# EAGLE design Two Nine Five Rev 1 (EAGLE 9.0.0)
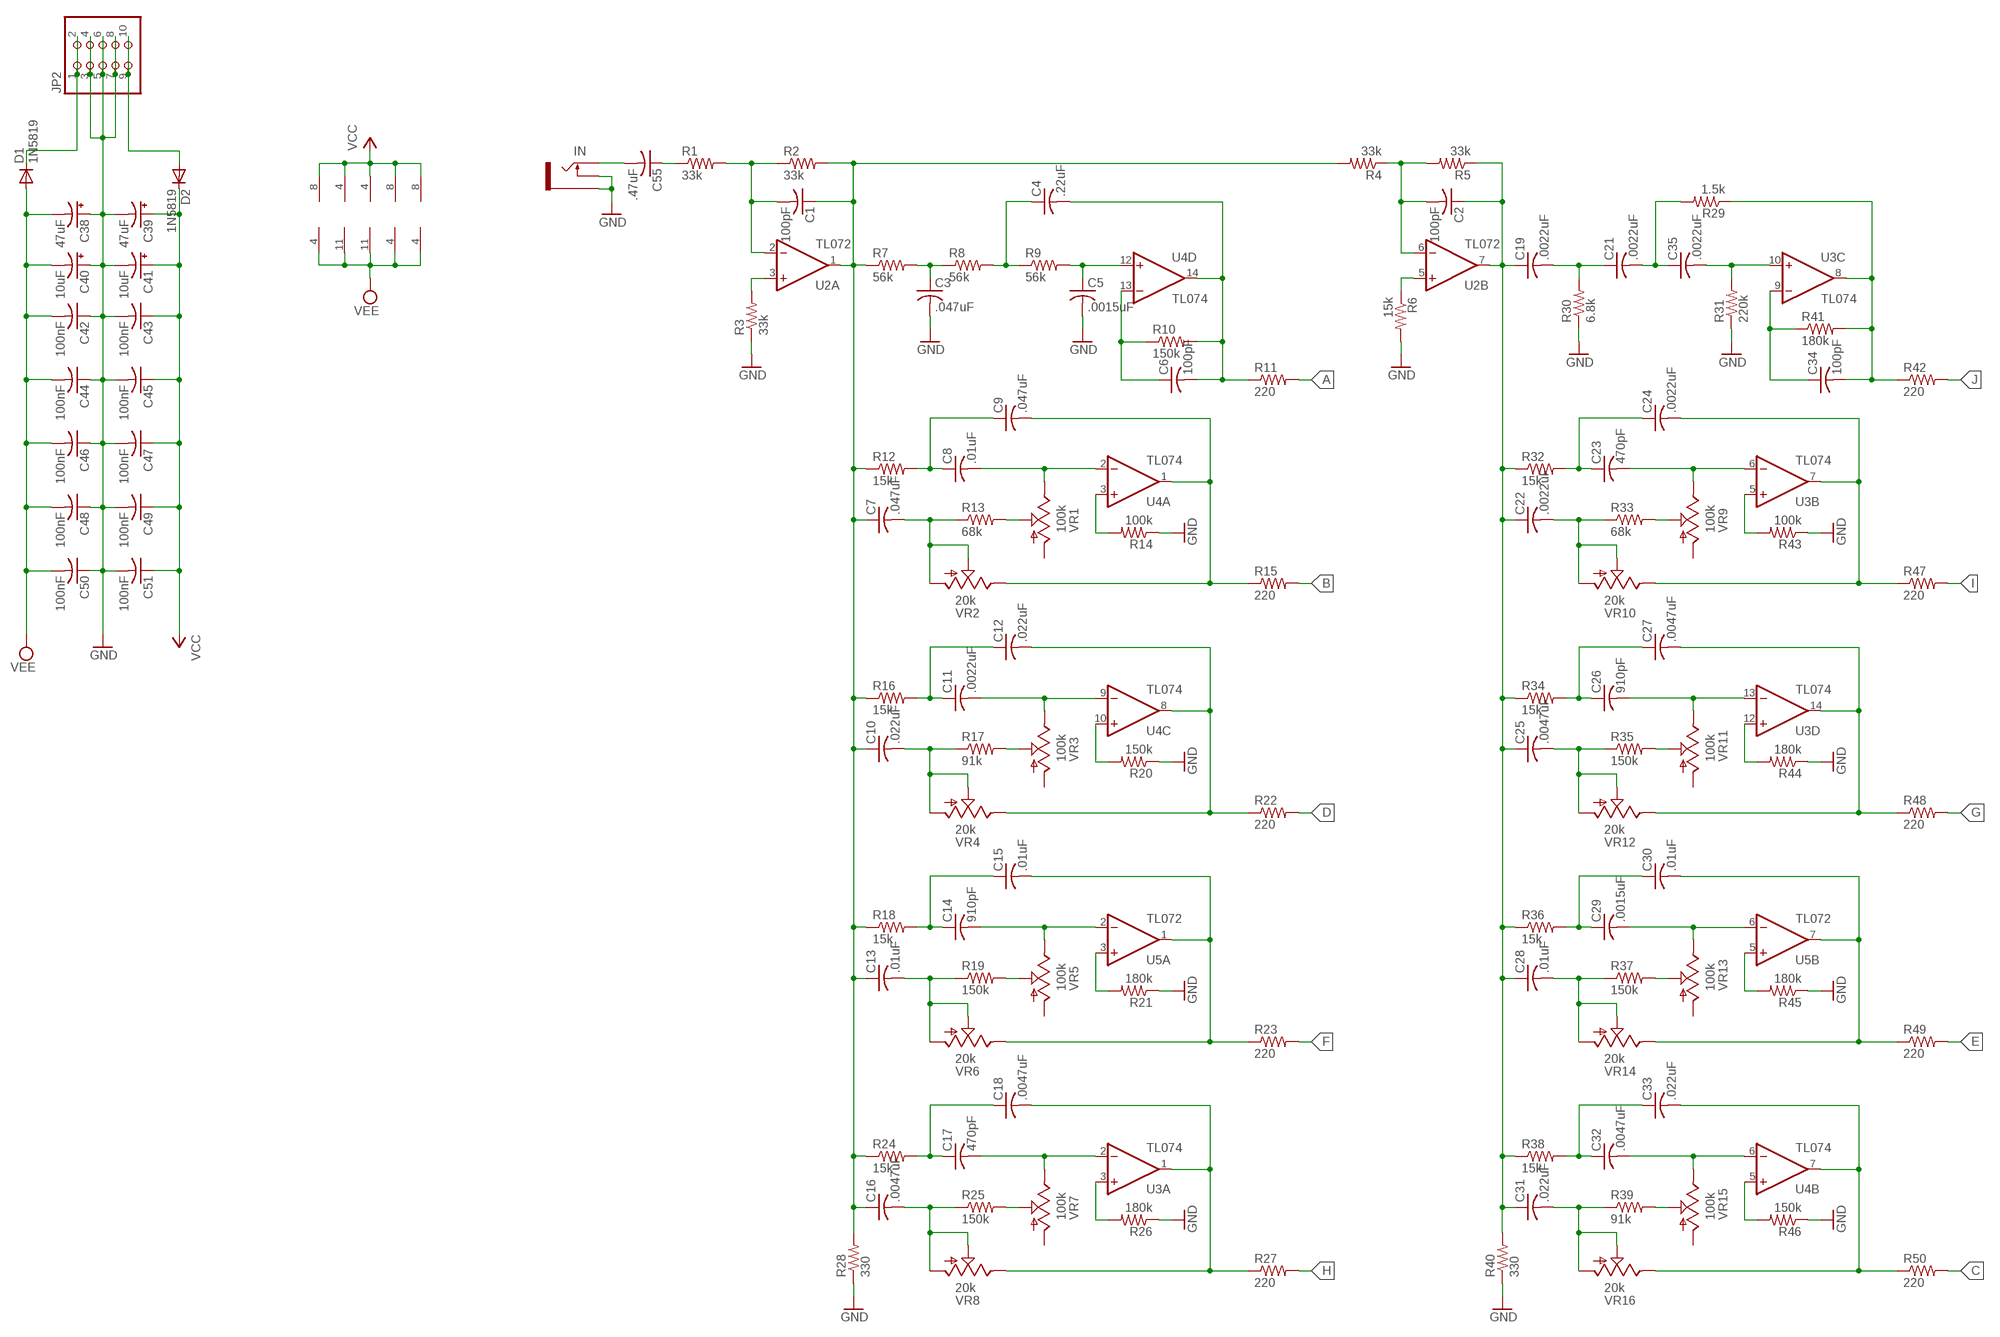
[diagram p0: schematic, sheet 1, part 1 of 2]
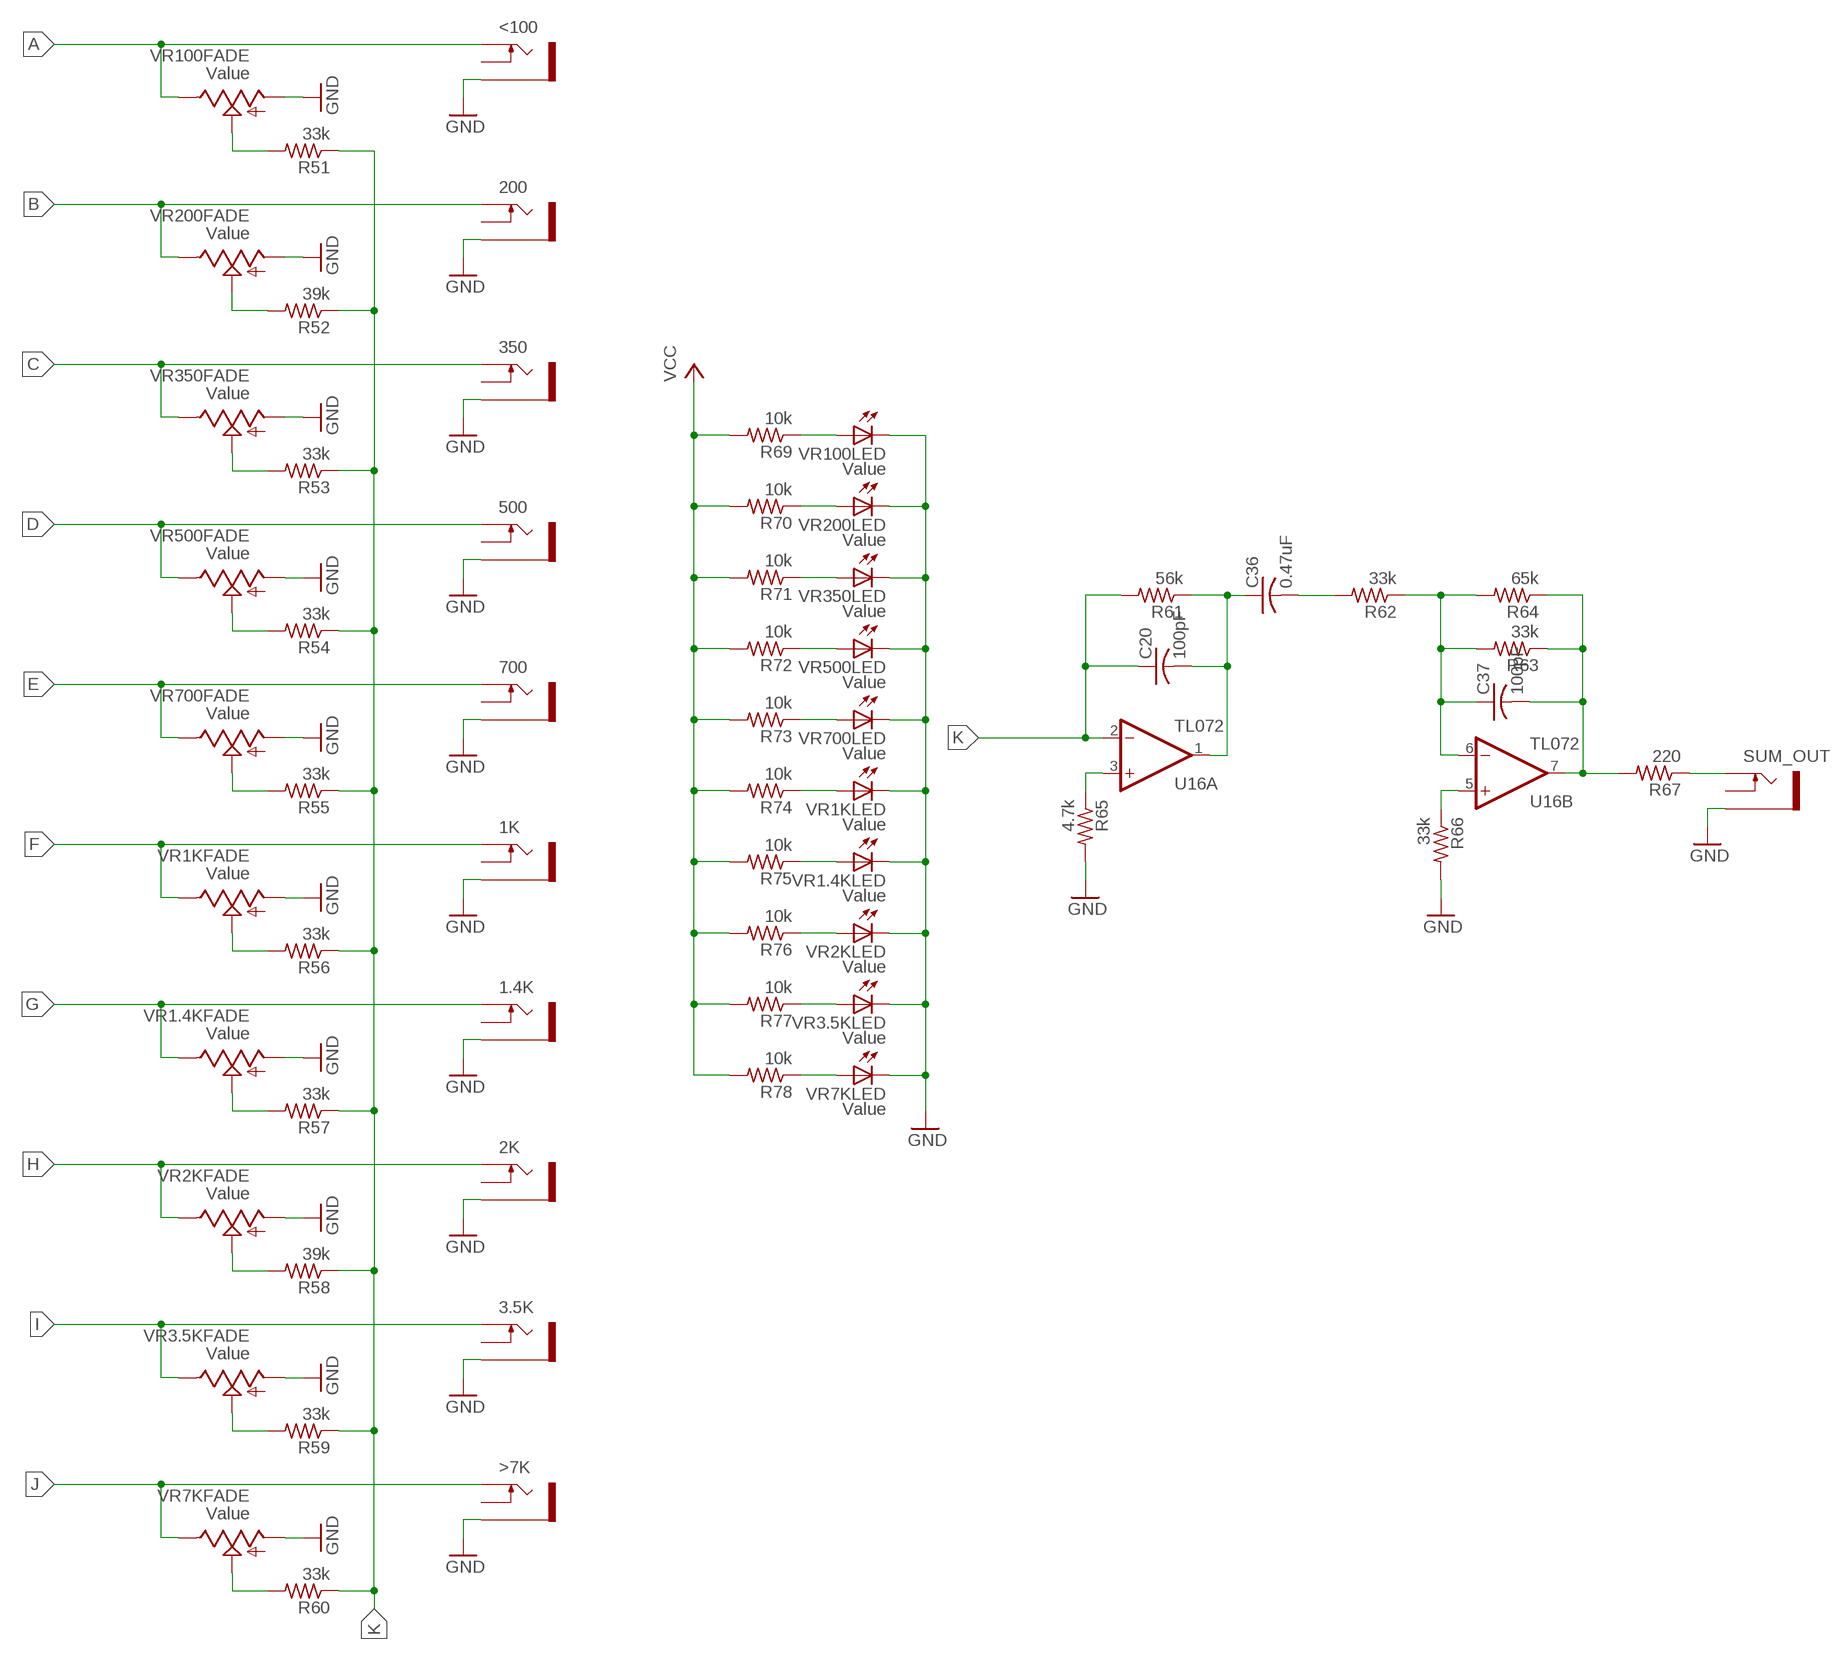
[diagram p1: schematic, sheet 1, part 2 of 2]

## Parts
1.4K  THONKICONNNEW  [WQP-PJ301M-12_JACK]
1K  THONKICONNNEW  [WQP-PJ301M-12_JACK]
2K  THONKICONNNEW  [WQP-PJ301M-12_JACK]
3.5K  THONKICONNNEW  [WQP-PJ301M-12_JACK]
200  THONKICONNNEW  [WQP-PJ301M-12_JACK]
350  THONKICONNNEW  [WQP-PJ301M-12_JACK]
500  THONKICONNNEW  [WQP-PJ301M-12_JACK]
700  THONKICONNNEW  [WQP-PJ301M-12_JACK]
<100  THONKICONNNEW  [WQP-PJ301M-12_JACK]
>7K  THONKICONNNEW  [WQP-PJ301M-12_JACK]
C1  100pF  C-USC0603  [C0603]
C2  100pF  C-USC0603  [C0603]
C3  .047uF  C-USC0603  [C0603]
C4  .22uF  C-USC0603  [C0603]
C5  .0015uF  C-USC0603  [C0603]
C6  100pF  C-USC0603  [C0603]
C7  .047uF  C-USC0603  [C0603]
C8  .01uF  C-USC0603  [C0603]
C9  .047uF  C-USC0603  [C0603]
C10  .022uF  C-USC0603  [C0603]
C11  .0022uF  C-USC0603  [C0603]
C12  .022uF  C-USC0603  [C0603]
C13  .01uF  C-USC0603  [C0603]
C14  910pF  C-USC0603  [C0603]
C15  .01uF  C-USC0603  [C0603]
C16  .0047uF  C-USC0603  [C0603]
C17  470pF  C-USC0603  [C0603]
C18  .0047uF  C-USC0603  [C0603]
C19  .0022uF  C-USC0603  [C0603]
C20  100pF  C-USC0603  [C0603]
C21  .0022uF  C-USC0603  [C0603]
C22  .0022uF  C-USC0603  [C0603]
C23  470pF  C-USC0603  [C0603]
C24  .0022uF  C-USC0603  [C0603]
C25  .0047uF  C-USC0603  [C0603]
C26  910pF  C-USC0603  [C0603]
C27  .0047uF  C-USC0603  [C0603]
C28  .01uF  C-USC0603  [C0603]
C29  .0015uF  C-USC0603  [C0603]
C30  .01uF  C-USC0603  [C0603]
C31  .022uF  C-USC0603  [C0603]
C32  .0047uF  C-USC0603  [C0603]
C33  .022uF  C-USC0603  [C0603]
C34  100pF  C-USC0603  [C0603]
C35  .0022uF  C-USC0603  [C0603]
C36  0.47uF  C-USC0603  [C0603]
C37  100pF  C-USC0603  [C0603]
C38  47uF  CPOL-USD  [PANASONIC_D]
C39  47uF  CPOL-USD  [PANASONIC_D]
C40  10uF  CPOL-USB  [PANASONIC_B]
C41  10uF  CPOL-USB  [PANASONIC_B]
C42  100nF  C-USC0603  [C0603]
C43  100nF  C-USC0603  [C0603]
C44  100nF  C-USC0603  [C0603]
C45  100nF  C-USC0603  [C0603]
C46  100nF  C-USC0603  [C0603]
C47  100nF  C-USC0603  [C0603]
C48  100nF  C-USC0603  [C0603]
C49  100nF  C-USC0603  [C0603]
C50  100nF  C-USC0603  [C0603]
C51  100nF  C-USC0603  [C0603]
C55  .47uF  C-USC0603  [C0603]
D1  1N5819  DIODE-SOD123  [SOD123]
D2  1N5819  DIODE-SOD123  [SOD123]
IN  THONKICONNNEW  [WQP-PJ301M-12_JACK]
JP2  PINHD-2X5SMT  [2X05_SMT]
R1  33k  R-US_R0603  [R0603]
R2  33k  R-US_R0603  [R0603]
R3  33k  R-US_R0603  [R0603]
R4  33k  R-US_R0603  [R0603]
R5  33k  R-US_R0603  [R0603]
R6  15k  R-US_R0603  [R0603]
R7  56k  R-US_R0603  [R0603]
R8  56k  R-US_R0603  [R0603]
R9  56k  R-US_R0603  [R0603]
R10  150k  R-US_R0603  [R0603]
R11  220  R-US_R0603  [R0603]
R12  15k  R-US_R0603  [R0603]
R13  68k  R-US_R0603  [R0603]
R14  100k  R-US_R0603  [R0603]
R15  220  R-US_R0603  [R0603]
R16  15k  R-US_R0603  [R0603]
R17  91k  R-US_R0603  [R0603]
R18  15k  R-US_R0603  [R0603]
R19  150k  R-US_R0603  [R0603]
R20  150k  R-US_R0603  [R0603]
R21  180k  R-US_R0603  [R0603]
R22  220  R-US_R0603  [R0603]
R23  220  R-US_R0603  [R0603]
R24  15k  R-US_R0603  [R0603]
R25  150k  R-US_R0603  [R0603]
R26  180k  R-US_R0603  [R0603]
R27  220  R-US_R0603  [R0603]
R28  330  R-US_R0603  [R0603]
R29  1.5k  R-US_R0603  [R0603]
R30  6.8k  R-US_R0603  [R0603]
R31  220k  R-US_R0603  [R0603]
R32  15k  R-US_R0603  [R0603]
R33  68k  R-US_R0603  [R0603]
R34  15k  R-US_R0603  [R0603]
R35  150k  R-US_R0603  [R0603]
R36  15k  R-US_R0603  [R0603]
R37  150k  R-US_R0603  [R0603]
R38  15k  R-US_R0603  [R0603]
R39  91k  R-US_R0603  [R0603]
R40  330  R-US_R0603  [R0603]
R41  180k  R-US_R0603  [R0603]
R42  220  R-US_R0603  [R0603]
R43  100k  R-US_R0603  [R0603]
R44  180k  R-US_R0603  [R0603]
R45  180k  R-US_R0603  [R0603]
R46  150k  R-US_R0603  [R0603]
R47  220  R-US_R0603  [R0603]
R48  220  R-US_R0603  [R0603]
R49  220  R-US_R0603  [R0603]
R50  220  R-US_R0603  [R0603]
R51  33k  R-US_R0603  [R0603]
R52  39k  R-US_R0603  [R0603]
R53  33k  R-US_R0603  [R0603]
R54  33k  R-US_R0603  [R0603]
R55  33k  R-US_R0603  [R0603]
R56  33k  R-US_R0603  [R0603]
R57  33k  R-US_R0603  [R0603]
R58  39k  R-US_R0603  [R0603]
R59  33k  R-US_R0603  [R0603]
R60  33k  R-US_R0603  [R0603]
R61  56k  R-US_R0603  [R0603]
R62  33k  R-US_R0603  [R0603]
R63  33k  R-US_R0603  [R0603]
R64  65k  R-US_R0603  [R0603]
R65  4.7k  R-US_R0603  [R0603]
R66  33k  R-US_R0603  [R0603]
R67  220  R-US_R0603  [R0603]
R69  10k  R-US_R0603  [R0603]
R70  10k  R-US_R0603  [R0603]
R71  10k  R-US_R0603  [R0603]
R72  10k  R-US_R0603  [R0603]
R73  10k  R-US_R0603  [R0603]
R74  10k  R-US_R0603  [R0603]
R75  10k  R-US_R0603  [R0603]
R76  10k  R-US_R0603  [R0603]
R77  10k  R-US_R0603  [R0603]
R78  10k  R-US_R0603  [R0603]
SUM_OUT  THONKICONNNEW  [WQP-PJ301M-12_JACK]
U2  TL072  TL072_SMD  [SO08]
U3  TL074  TL074_SMD  [SO14]
U4  TL074  TL074_SMD  [SO14]
U5  TL072  TL072_SMD  [SO08]
U16  TL072  TL072_SMD  [SO08]
VR1  100k  TRIM_US-RJ9W  [RJ9W]
VR1.4K  Value  ALPHA_20MM_ILLUM_FADER  [ALPHA_ILL_FADER_20MM_REV2]
VR1K  Value  ALPHA_20MM_ILLUM_FADER  [ALPHA_ILL_FADER_20MM_REV2]
VR2  20k  TRIM_US-RJ9W  [RJ9W]
VR2K  Value  ALPHA_20MM_ILLUM_FADER  [ALPHA_ILL_FADER_20MM_REV2]
VR3  100k  TRIM_US-RJ9W  [RJ9W]
VR3.5K  Value  ALPHA_20MM_ILLUM_FADER  [ALPHA_ILL_FADER_20MM_REV2]
VR4  20k  TRIM_US-RJ9W  [RJ9W]
VR5  100k  TRIM_US-RJ9W  [RJ9W]
VR6  20k  TRIM_US-RJ9W  [RJ9W]
VR7  100k  TRIM_US-RJ9W  [RJ9W]
VR7K  Value  ALPHA_20MM_ILLUM_FADER  [ALPHA_ILL_FADER_20MM_REV2]
VR8  20k  TRIM_US-RJ9W  [RJ9W]
VR9  100k  TRIM_US-RJ9W  [RJ9W]
VR10  20k  TRIM_US-RJ9W  [RJ9W]
VR11  100k  TRIM_US-RJ9W  [RJ9W]
VR12  20k  TRIM_US-RJ9W  [RJ9W]
VR13  100k  TRIM_US-RJ9W  [RJ9W]
VR14  20k  TRIM_US-RJ9W  [RJ9W]
VR15  100k  TRIM_US-RJ9W  [RJ9W]
VR16  20k  TRIM_US-RJ9W  [RJ9W]
VR100  Value  ALPHA_20MM_ILLUM_FADER  [ALPHA_ILL_FADER_20MM_REV2]
VR200  Value  ALPHA_20MM_ILLUM_FADER  [ALPHA_ILL_FADER_20MM_REV2]
VR350  Value  ALPHA_20MM_ILLUM_FADER  [ALPHA_ILL_FADER_20MM_REV2]
VR500  Value  ALPHA_20MM_ILLUM_FADER  [ALPHA_ILL_FADER_20MM_REV2]
VR700  Value  ALPHA_20MM_ILLUM_FADER  [ALPHA_ILL_FADER_20MM_REV2]

## Nets
A: <100.P$1_TIP(TIP) R11.2 VR100.1(FADE:E)
B: 200.P$1_TIP(TIP) R15.2 VR200.1(FADE:E)
C: 350.P$1_TIP(TIP) R50.2 VR350.1(FADE:E)
D: 500.P$1_TIP(TIP) R22.2 VR500.1(FADE:E)
E: 700.P$1_TIP(TIP) R49.2 VR700.1(FADE:E)
F: 1K.P$1_TIP(TIP) R23.2 VR1K.1(FADE:E)
G: 1.4K.P$1_TIP(TIP) R48.2 VR1.4K.1(FADE:E)
GND: 1.4K.P$3_SLEEVE(SLEEVE) 1K.P$3_SLEEVE(SLEEVE) 2K.P$3_SLEEVE(SLEEVE) 3.5K.P$3_SLEEVE(SLEEVE) 200.P$3_SLEEVE(SLEEVE) 350.P$3_SLEEVE(SLEEVE) 500.P$3_SLEEVE(SLEEVE) 700.P$3_SLEEVE(SLEEVE) <100.P$3_SLEEVE(SLEEVE) >7K.P$3_SLEEVE(SLEEVE) C3.2 C5.2 C38.+ C39.- C40.+ C41.- C42.1 C43.2 C44.1 C45.2 C46.1 C47.2 C48.1 C49.2 C50.1 C51.2 IN.P$2_SWITCH(SWITCH) IN.P$3_SLEEVE(SLEEVE) JP2.3 JP2.4 JP2.5 JP2.6 JP2.7 JP2.8 R3.1 R6.2 R14.1 R20.1 R21.1 R26.1 R28.1 R30.1 R31.1 R40.1 R43.1 R44.1 R45.1 R46.1 R65.2 R66.2 SUM_OUT.P$3_SLEEVE(SLEEVE) VR1.4K.3(FADE:A) VR1.4K.E(LED:C) VR1K.3(FADE:A) VR1K.E(LED:C) VR2K.3(FADE:A) VR2K.E(LED:C) VR3.5K.3(FADE:A) VR3.5K.E(LED:C) VR7K.3(FADE:A) VR7K.E(LED:C) VR100.3(FADE:A) VR100.E(LED:C) VR200.3(FADE:A) VR200.E(LED:C) VR350.3(FADE:A) VR350.E(LED:C) VR500.3(FADE:A) VR500.E(LED:C) VR700.3(FADE:A) VR700.E(LED:C)
H: 2K.P$1_TIP(TIP) R27.2 VR2K.1(FADE:E)
I: 3.5K.P$1_TIP(TIP) R47.2 VR3.5K.1(FADE:E)
J: >7K.P$1_TIP(TIP) R42.2 VR7K.1(FADE:E)
K: C20.1 R51.1 R52.1 R53.1 R54.1 R55.1 R56.1 R57.1 R58.1 R59.1 R60.1 R61.2 U16.2(A:-IN)
N$1: C55.2 IN.P$1_TIP(TIP)
N$2: C1.2 R1.2 R2.1 U2.2(A:-IN)
N$3: C1.1 C7.1 C10.1 C13.1 C16.1 R2.2 R4.2 R7.1 R12.1 R16.1 R18.1 R24.1 R28.2 U2.1(A:OUT)
N$4: R3.2 U2.3(A:+IN)
N$5: C3.1 R7.2 R8.1
N$6: C2.2 R4.1 R5.2 U2.6(B:-IN)
N$7: C2.1 C19.1 C22.1 C25.1 C28.1 C31.1 R5.1 R32.1 R34.1 R36.1 R38.1 R40.2 U2.7(B:OUT)
N$8: R6.1 U2.5(B:+IN)
N$9: C4.1 R8.2 R9.1
N$10: C5.1 R9.2 U4.12(D:+IN)
N$11: C4.2 C6.2 R10.2 R11.1 U4.14(D:OUT)
N$12: C6.1 R10.1 U4.13(D:-IN)
N$13: C8.1 C9.1 R12.2
N$14: C7.2 R13.1 VR2.A VR2.S
N$15: R13.2 VR1.S
N$16: C8.2 U4.2(A:-IN) VR1.E
N$17: R14.2 U4.3(A:+IN)
N$18: C9.2 R15.1 U4.1(A:OUT) VR2.E
N$19: R26.2 U3.3(A:+IN)
N$20: C11.1 C12.1 R16.2
N$21: C10.2 R17.1 VR4.A VR4.S
N$22: R17.2 VR3.S
N$23: C11.2 U4.9(C:-IN) VR3.E
N$24: C12.2 R22.1 U4.8(C:OUT) VR4.E
N$25: C17.1 C18.1 R24.2
N$26: C14.1 C15.1 R18.2
N$27: C13.2 R19.1 VR6.A VR6.S
N$28: R19.2 VR5.S
N$29: C14.2 U5.2(A:-IN) VR5.E
N$30: C15.2 R23.1 U5.1(A:OUT) VR6.E
N$31: R20.2 U4.10(C:+IN)
N$32: R21.2 U5.3(A:+IN)
N$33: C16.2 R25.1 VR8.A VR8.S
N$34: R25.2 VR7.S
N$35: C17.2 U3.2(A:-IN) VR7.E
N$36: C18.2 R27.1 U3.1(A:OUT) VR8.E
N$37: C19.2 C21.1 R30.2
N$38: C35.2 R31.2 U3.10(C:+IN)
N$39: C21.2 C35.1 R29.2
N$40: R65.1 U16.3(A:+IN)
N$41: C34.2 R29.1 R41.2 R42.1 U3.8(C:OUT)
N$42: C23.1 C24.1 R32.2
N$43: C22.2 R33.1 VR10.A VR10.S
N$44: R39.2 VR15.S
N$45: C23.2 U3.6(B:-IN) VR9.E
N$46: C24.2 R47.1 U3.7(B:OUT) VR10.E
N$47: C26.1 C27.1 R34.2
N$48: C25.2 R35.1 VR12.A VR12.S
N$49: R37.2 VR13.S
N$50: C26.2 U3.13(D:-IN) VR11.E
N$51: C27.2 R48.1 U3.14(D:OUT) VR12.E
N$52: C29.1 C30.1 R36.2
N$53: C28.2 R37.1 VR14.A VR14.S
N$54: R35.2 VR11.S
N$55: C29.2 U5.6(B:-IN) VR13.E
N$56: C30.2 R49.1 U5.7(B:OUT) VR14.E
N$57: C32.1 C33.1 R38.2
N$58: C31.2 R39.1 VR16.A VR16.S
N$59: R33.2 VR9.S
N$60: C32.2 U4.6(B:-IN) VR15.E
N$61: C33.2 R50.1 U4.7(B:OUT) VR16.E
N$62: R51.2 VR100.2(FADE:S)
N$63: C34.1 R41.1 U3.9(C:-IN)
N$64: R43.2 U3.5(B:+IN)
N$65: R44.2 U3.12(D:+IN)
N$66: R45.2 U5.5(B:+IN)
N$67: R46.2 U4.5(B:+IN)
N$68: R66.1 U16.5(B:+IN)
N$70: R52.2 VR200.2(FADE:S)
N$71: C20.2 C36.1 R61.1 U16.1(A:OUT)
N$72: R53.2 VR350.2(FADE:S)
N$73: C36.2 R62.2
N$74: R54.2 VR500.2(FADE:S)
N$75: C37.1 R62.1 R63.2 R64.2 U16.6(B:-IN)
N$76: R55.2 VR700.2(FADE:S)
N$77: C37.2 R63.1 R64.1 R67.2 U16.7(B:OUT)
N$78: R56.2 VR1K.2(FADE:S)
N$79: R67.1 SUM_OUT.P$1_TIP(TIP)
N$80: R57.2 VR1.4K.2(FADE:S)
N$81: D2.A JP2.9 JP2.10
N$82: R58.2 VR2K.2(FADE:S)
N$83: R69.1 VR100.B(LED:A)
N$84: R59.2 VR3.5K.2(FADE:S)
N$85: D1.C JP2.1 JP2.2
N$86: R60.2 VR7K.2(FADE:S)
N$87: R70.1 VR200.B(LED:A)
N$88: R71.1 VR350.B(LED:A)
N$89: R72.1 VR500.B(LED:A)
N$90: R73.1 VR700.B(LED:A)
N$91: R74.1 VR1K.B(LED:A)
N$92: R75.1 VR1.4K.B(LED:A)
N$93: R76.1 VR2K.B(LED:A)
N$94: R77.1 VR3.5K.B(LED:A)
N$95: R78.1 VR7K.B(LED:A)
N$96: C55.1 R1.1
VCC: C39.+ C41.+ C43.1 C45.1 C47.1 C49.1 C51.1 D2.C R69.2 R70.2 R71.2 R72.2 R73.2 R74.2 R75.2 R76.2 R77.2 R78.2 U2.8(P:V+) U3.4(P:V+) U4.4(P:V+) U5.8(P:V+) U16.8(P:V+)
VEE: C38.- C40.- C42.2 C44.2 C46.2 C48.2 C50.2 D1.A U2.4(P:V-) U3.11(P:V-) U4.11(P:V-) U5.4(P:V-) U16.4(P:V-)
Unconnected: 1.4K.P$2_SWITCH(SWITCH) 1K.P$2_SWITCH(SWITCH) 2K.P$2_SWITCH(SWITCH) 3.5K.P$2_SWITCH(SWITCH) 200.P$2_SWITCH(SWITCH) 350.P$2_SWITCH(SWITCH) 500.P$2_SWITCH(SWITCH) 700.P$2_SWITCH(SWITCH) <100.P$2_SWITCH(SWITCH) >7K.P$2_SWITCH(SWITCH) SUM_OUT.P$2_SWITCH(SWITCH) VR1.A VR3.A VR5.A VR7.A VR9.A VR11.A VR13.A VR15.A

## Library data of the parts
1.4K 1K 2K 3.5K 200 350 500 700 <100 >7K IN SUM_OUT = MusicThingModular:THONKICONN: 3.5mm socket for Eurorack modular synths
C1-C37 C42-C51 C55 = adafruit:C-US: CAPACITOR, American symbol
C38-C41 = rcl:CPOL-US: POLARIZED CAPACITOR, American symbol; SPICEPREFIX: C
D1 D2 = shades_v30:DIODE-: DIODE
JP2 = pinhead+:PINHD-2X5: PIN HEADER
R1-R67 R69-R78 = adafruit:R-US_: RESISTOR, American symbol
U2 U5 U16 = MusicThingModular:TL072: Generic Dual Op Amp
U3 U4 = MusicThingModular:TL074: Generic Quad Op Amp
VR1-VR16 = pot:TRIM_US-: POTENTIOMETER
VR1.4K VR1K VR2K VR3.5K VR7K VR100 VR200 VR350 VR500 VR700 = MusicThingModular:ALPHA_20MM_ILLUM_FADER: 20mm Alpha Illuminated Fader

## Board
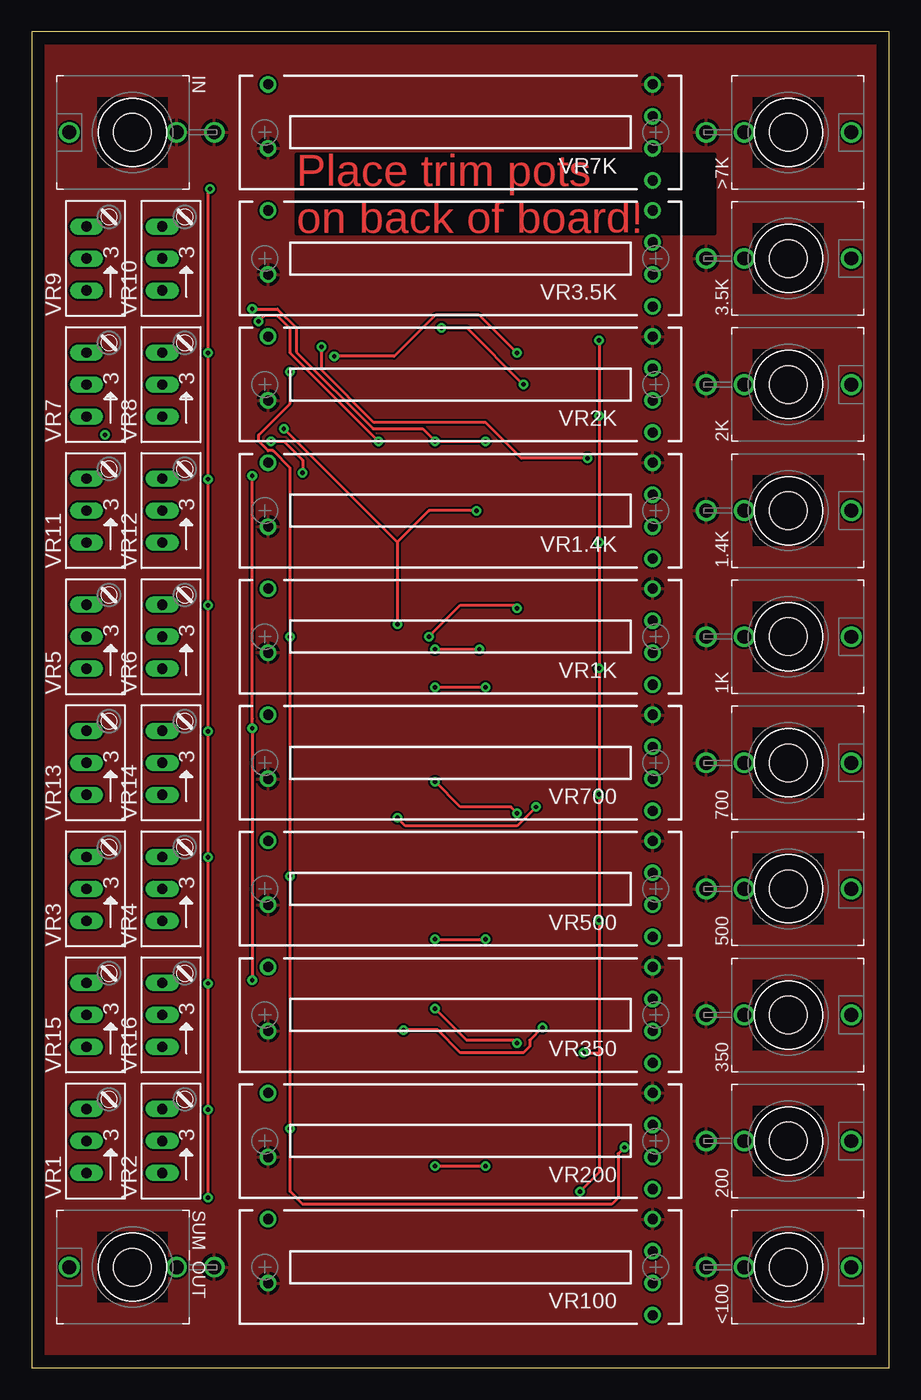
[diagram p2: board, top side]
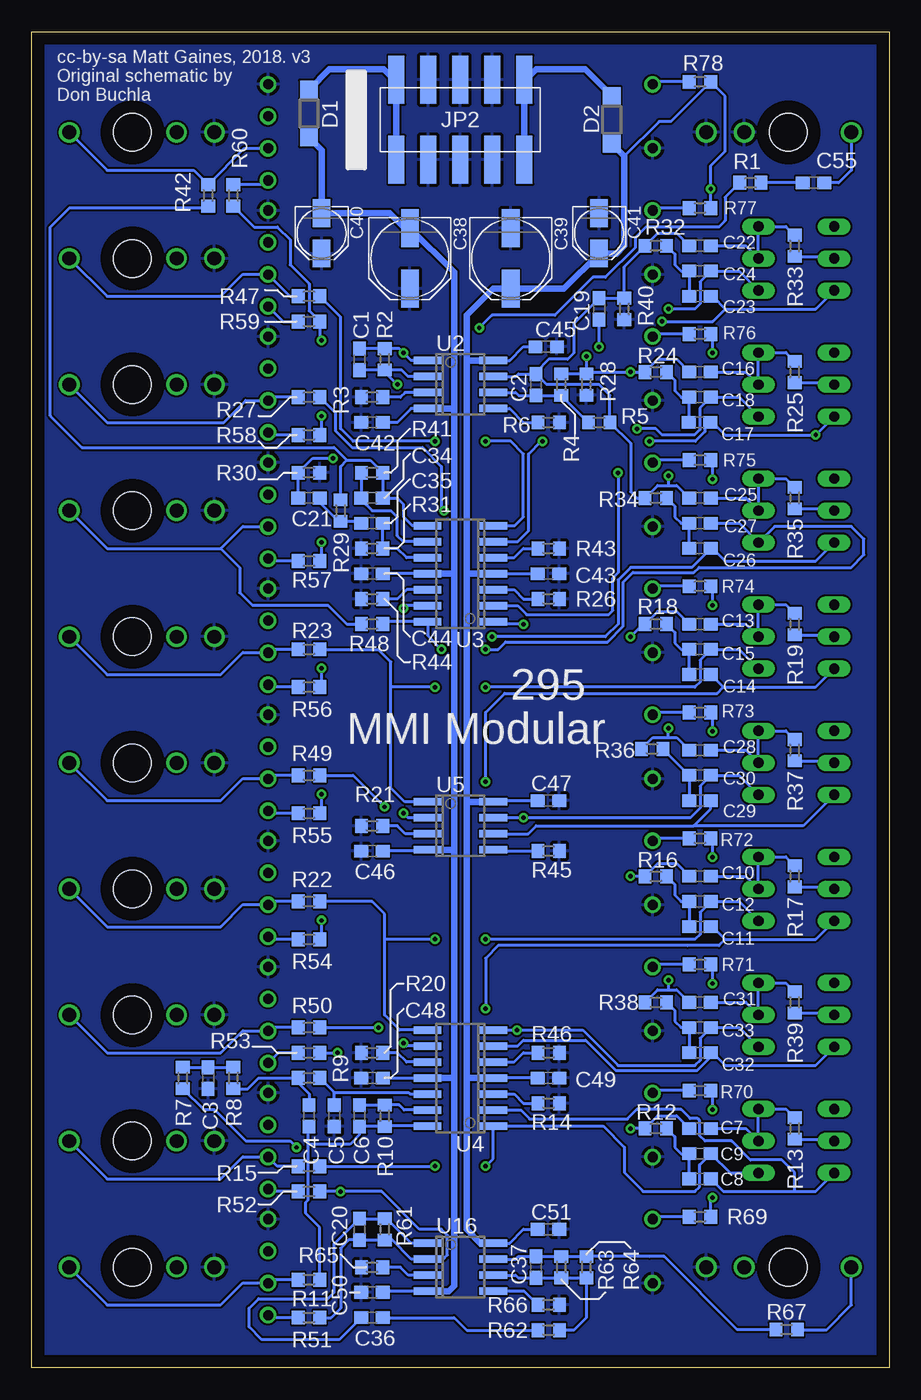
[diagram p3: board, bottom side, seen from below]

Size 68 x 106 mm. Coordinates in mm from the lower left corner, seen from the top.
Outline: 0,0 68,0 68,106 0,106 0,0
Copper layers (1*16): Top 0.035mm / dielectric 1.5mm / Bottom 0.035mm
Design rules "default": minimum track width 6mil, minimum drill 0.35mm, track to track 6mil, track to pad 6mil, pad to pad 6mil, via to via 6mil, smd to smd 6mil, copper to edge 40mil, drill to drill 6mil, minimum pad ring 10mil, minimum via ring 8mil, stop-mask expansion 4mil, vias tented up to drill 0mil, thermal gap 10mil
Holes 3 mm at 60,8 60,18 60,28 60,38 60,48 60,58 60,68 60,78 60,88 60,98 8,8 8,98

### Footprints (pad centres in the part's own frame; a part is rotated, then mirrored left to right if it is on the bottom)
WQP-PJ301M-12_JACK = drill 1.1: P$1_TIP 0,5; P$2_SWITCH 0,-3.5; P$3_SLEEVE 0,-6.5
C0603 = smd 1.1 x 1: 1 -0.85,0; 2 0.85,0
PANASONIC_D = smd 3 x 1.4: + 2.4,0; - -2.4,0
PANASONIC_B = smd 2.2 x 1.4: + 1.6,0; - -1.6,0
SOD123 = smd 1.4 x 1.4: A 1.9,0; C -1.9,0
2X05_SMT = smd 1.27 x 3.81: 1 -5.08,-3.175; 2 -5.08,3.175; 3 -2.54,-3.175; 4 -2.54,3.175; 5 0,-3.175; 6 0,3.175; 7 2.54,-3.175; 8 2.54,3.175; 9 5.08,-3.175; 10 5.08,3.175
R0603 = smd 1 x 1.1: 1 -0.85,0; 2 0.85,0
SO08 = smd 0.6 x 2.2: 1 -1.905,-2.6; 2 -0.635,-2.6; 3 0.635,-2.6; 4 1.905,-2.6; 5 1.905,2.6; 6 0.635,2.6; 7 -0.635,2.6; 8 -1.905,2.6
SO14 = smd 0.6 x 2.2: 1 -3.81,-2.6; 2 -2.54,-2.6; 3 -1.27,-2.6; 4 0,-2.6; 5 1.27,-2.6; 6 2.54,-2.6; 7 3.81,-2.6; 8 3.81,2.6; 9 2.54,2.6; 10 1.27,2.6; 11 0,2.6; 12 -1.27,2.6; 13 -2.54,2.6; 14 -3.81,2.6
RJ9W = drill 0.813 long: A 2.54,0.635; E -2.54,0.635; S 0,0.635
ALPHA_ILL_FADER_20MM_REV2 = drill 0.8: 1 -15.24,1.27; 2 -15.24,3.81; 3 15.24,1.27; B 15.24,-3.81; E -15.24,-3.81; L -15.24,-1.27

### Placement (x,y rotation side)
1.4K  60,68 270 top
1K  60,58 270 top
2K  60,78 270 top
3.5K  60,88 270 top
200  60,18 270 top
350  60,28 270 top
500  60,38 270 top
700  60,48 270 top
<100  60,8 270 top
>7K  60,98 270 top
C1  42,80 270 bottom
C2  28,77.99 270 bottom
C3  54,23 270 bottom
C4  46,20 270 bottom
C5  44,20 270 bottom
C6  42,20 270 bottom
C7  15,19 0 bottom
C8  15,15 0 bottom
C9  15,17 0 bottom
C10  15,39 0 bottom
C11  15,35 0 bottom
C12  15,37 0 bottom
C13  15,59 0 bottom
C14  15,55 0 bottom
C15  15,57 0 bottom
C16  15,79 0 bottom
C17  15.04,75 0 bottom
C18  15,77 0 bottom
C19  23,84 270 bottom
C20  42,11 90 bottom
C21  46,69 0 bottom
C22  15,89 0 bottom
C23  15,85 0 bottom
C24  15,87 0 bottom
C25  15,69 0 bottom
C26  15,65 0 bottom
C27  15,67 0 bottom
C28  15,49 0 bottom
C29  15,45 0 bottom
C30  15,47 0 bottom
C31  15,29 0 bottom
C32  15,25 0 bottom
C33  15,27 0 bottom
C34  41,69 0 bottom
C35  41,67 0 bottom
C36  41,4 0 bottom
C37  28,8 90 bottom
C38  38,88 270 bottom
C39  30,88 270 bottom
C40  45,90 270 bottom
C41  23,90 270 bottom
C42  41,75 0 bottom
C43  27,63 0 bottom
C44  41,63 0 bottom
C45  27.19,81 0 bottom
C46  41,41 0 bottom
C47  27,45 0 bottom
C48  41,23 0 bottom
C49  27,23 0 bottom
C50  41,6 0 bottom
C51  27,11 0 bottom
C55  6,94 0 bottom
D1  46,99.5 270 bottom
D2  22,99 90 bottom
IN  8,98 90 top
JP2  34,99 0 bottom
R1  11,94 180 bottom
R2  40,80 90 bottom
R3  41,77 0 bottom
R4  26,78 90 bottom
R5  23,75 180 bottom
R6  27,75 0 bottom
R7  56,23 90 bottom
R8  52,23 270 bottom
R9  46,23 0 bottom
R10  40,20 270 bottom
R11  46,7 180 bottom
R12  18.5,19 0 bottom
R13  7.5,19 270 bottom
R14  27,21 180 bottom
R15  46,16 180 bottom
R16  18.5,39 0 bottom
R17  7.5,39 270 bottom
R18  18.5,59 0 bottom
R19  7.5,59 270 bottom
R20  41,25 0 bottom
R21  41,43 0 bottom
R22  46,37 180 bottom
R23  46,57 180 bottom
R24  18.5,79 0 bottom
R25  7.5,79 270 bottom
R26  27,61 180 bottom
R27  46,77 180 bottom
R28  24,78 90 bottom
R29  43.5,68 270 bottom
R30  46,71 180 bottom
R31  41,65 0 bottom
R32  18.5,89 0 bottom
R33  7.5,89 270 bottom
R34  18.5,69 0 bottom
R35  7.5,69 270 bottom
R36  18.79,49.1 0 bottom
R37  7.5,49 270 bottom
R38  18.5,29 0 bottom
R39  7.5,29 270 bottom
R40  21,84 90 bottom
R41  41,71 0 bottom
R42  54,93 90 bottom
R43  27,65 180 bottom
R44  41,61 0 bottom
R45  27,41 180 bottom
R46  27,25 180 bottom
R47  46,85 180 bottom
R48  41,59 180 bottom
R49  46,47 180 bottom
R50  46,27 180 bottom
R51  46,4 180 bottom
R52  46,14 180 bottom
R53  46,25 180 bottom
R54  46,34 180 bottom
R55  46,44 180 bottom
R56  46,54 180 bottom
R57  46,64 180 bottom
R58  46,74 180 bottom
R59  46,83 180 bottom
R60  52,93 90 bottom
R61  40,11 270 bottom
R62  27,3 180 bottom
R63  26,8 270 bottom
R64  24,8 270 bottom
R65  41,8 180 bottom
R66  27,5 0 bottom
R67  8.13,3.05 180 bottom
R69  15,12 0 bottom
R70  15,22 0 bottom
R71  15,32 0 bottom
R72  15,42 0 bottom
R73  15,52 0 bottom
R74  15,62 0 bottom
R75  15,72 0 bottom
R76  15,82 0 bottom
R77  15,92 0 bottom
R78  15,102 0 bottom
SUM_OUT  8,8 90 top
U2  34,78 270 bottom
U3  34,63 90 bottom
U4  34,23 90 bottom
U5  34,43 270 bottom
U16  34,8 270 bottom
VR1  5,18 90 top
VR1.4K  34,68 180 top
VR1K  34,58 180 top
VR2  11,18 90 top
VR2K  34,78 180 top
VR3  5,38 90 top
VR3.5K  34,88 180 top
VR4  11,38 90 top
VR5  5,58 90 top
VR6  11,58 90 top
VR7  5,78 90 top
VR7K  34,98 180 top
VR8  11,78 90 top
VR9  5,88 90 top
VR10  11,88 90 top
VR11  5,68 90 top
VR12  11,68 90 top
VR13  5,48 90 top
VR14  11,48 90 top
VR15  5,28 90 top
VR16  11,28 90 top
VR100  34,8 180 top
VR200  34,18 180 top
VR350  34,28 180 top
VR500  34,38 180 top
VR700  34,48 180 top

### Tracks (layer width: path | path; a pad name or v marks a point on that pad's centre or on a via)
A
  Bottom 0.254: R11.2 48.97,7 VR100.1 49.26,6.75 51.25,6.75 53,5 62,5 <100.P$1_TIP
B
  Bottom 0.254: R15.2 48.51,16 VR200.1 49.26,16.75 51.25,16.75 53,15 62,15 200.P$1_TIP
C
  Bottom 0.254: R50.2 48.97,27 VR350.1 | VR350.1 | 350.P$1_TIP 62,25 53,25 51.25,26.75 49.25,26.75 VR350.1
D
  Bottom 0.254: R22.2 48.97,37 VR500.1 49.26,36.75 51.25,36.75 53,35 62,35 500.P$1_TIP
E
  Bottom 0.254: 700.P$1_TIP 62,45 53,45 51.25,46.75 49.26,46.75 | 49.26,46.75 VR700.1 | R49.2 49.01,47 49.26,46.75
F
  Bottom 0.254: 1K.P$1_TIP 62,55 53,55 51.25,56.75 49.26,56.75 VR1K.1 48.97,57 R23.2
G
  Bottom 0.254: 1.4K.P$1_TIP 62,65 53,65 | 53,65 51.25,66.75 49.26,66.75 VR1.4K.1 | 53,65 51.5,63.5 51.5,61.5 50.5,60.5 44.5,60.5 43,59 R48.2
GND
  pour Top: -1,107 -1,-1 69,-1 69,107
  pour Bottom: 69,-1 -1,-1 -1,107 69,107
H
  Bottom 0.254: 2K.P$1_TIP 62,75 52.75,75 51.02,76.73 VR2K.1 48.97,77 R27.2
I
  Bottom 0.254: 3.5K.P$1_TIP 62,85 53,85 51.25,86.75 49.26,86.75 VR3.5K.1 47.51,85 R47.2
J
  Bottom 0.254: >7K.P$1_TIP 62,95 55.15,95 R42.2 51.12,96.73 VR7K.1
K  (via drill 0.35)
  Top 0.254: v45,81.5 v45,75.5 v45,65.5 v45,55.5 v45,45.5 v45,35.5 45,25 | 45,25 45,15.5 v43.5,14 | v43.75,25 45,25
  Bottom 0.254: R51.1 44.25,4 43.5,4.75 43.5,9.5 42.85,10.15 C20.1 R61.2 39.4,10.15 37.88,8.63 U16.2 35.37,8.63 35.03,8.97 35.03,10.53 35.5,11 37.25,11 40.25,14 v43.5,14 R52.1 | R60.1 50.35,90.5 48.5,90.5 47.5,89.5 47.5,87.5 46,86 46,83.85 R59.1 45.15,81.65 v45,81.5 | R54.1 45,34.15 v45,35.5 | R55.1 45,44.15 v45,45.5 | R56.1 45,54.15 v45,55.5 | R57.1 45,64.15 v45,65.5 | R58.1 45,74.15 v45,75.5 | R53.1 v43.75,25
N$1
  Bottom 0.254: IN.P$1_TIP 3,95 4,94 C55.2
N$2  (via drill 0.35)
  Top 0.254: v32.5,82.5 34.5,82.5 v39,78
  Bottom 0.254: U2.2 38.13,78.64 38.65,79.15 R2.1 | R2.1 C1.2 | R1.2 13,92.85 13,91 13.5,90.5 19.3,90.5 20.13,89.67 20.13,88.87 22.5,86.5 23.5,86.5 26.5,83.5 31.5,83.5 v32.5,82.5 | v39,78 40,79 R2.1
N$3  (via drill 0.35)
  Top 0.254: v20.5,79 20.5,76.5 18,74 18,73.5 18.76,72.74 19.15,72.74 20.5,71.39 v20.5,58 v20.5,39 v20.5,19 20.5,14 21.5,13 46,13 46.5,13.5 46.5,17 v47,17.5 | v38.5,80.5 35.5,83.5 32,83.5 28.75,80.25 v24,80.25
  Bottom 0.254: U2.1 37.91,79.91 v38.5,80.5 38.85,80.85 R2.2 C1.1 | C13.1 16.85,60 18.35,60 R18.1 19.5,59 v20.5,58 | C10.1 16.85,40 18.35,40 R16.1 v20.5,39 | R4.2 R28.2 | R28.2 23.85,79 v20.5,79 R24.1 18.35,80 16.85,80 C16.1 | C7.1 16.85,20 18.35,20 R12.1 v20.5,19 | R7.1 54.35,20.5 53.5,20.5 51,18 47.5,18 v47,17.5 | v24,80.25 R28.2
N$4
  Bottom 0.254: U2.3 38.38,77.36 38.75,77 R3.2
N$5
  Bottom 0.254: R8.1 C3.1 R7.2
N$6
  Bottom 0.254: U2.6 29.61,77.36 29.39,77.14 C2.2 R4.1 | R4.1 | R5.2 R4.1
N$7  (via drill 0.35)
  Top 0.254: v17.5,70.75 17.5,51.5 v17.5,50.75 v17.5,30.75
  Bottom 0.254: U2.7 29.61,78.64 29.41,78.84 C2.1 | C25.1 16.85,70 17.5,70 | 17.5,70 18.35,70 R34.1 20,69 20.5,69.5 20.5,73.35 R5.1 22.15,77.15 23,78 27.16,78 C2.1 | R36.1 18.74,50 17.5,50 | C28.1 16.85,50 17.5,50 | R38.1 18.35,30 17.5,30 | C31.1 16.85,30 17.5,30 | C22.1 16.85,90 18.35,90 R32.1 21,87.35 R40.2 C19.1 25,82.85 25,80.5 25.5,80 27,80 28,79 C2.1 | 17.5,50 v17.5,50.75 | v17.5,70.75 17.5,70 | v17.5,30.75 17.5,30
N$8
  Bottom 0.254: U2.5 30.09,76.09 29,75 R6.1
N$9
  Bottom 0.254: C4.1 46,21.75 46.85,22.6 R9.1 50,23 50.85,22.15 R8.2
N$10
  Bottom 0.254: C5.1 44,21.85 | 44,21.85 R9.2 | 44,21.85 38.1,21.85 37.98,21.73 U4.12
N$11
  Bottom 0.254: U4.14 39.96,19.19 R10.2 C6.2 42,18.5 42.75,17.75 46.07,17.75 | R11.1 45.15,11.15 46.25,12.25 46.25,13.15 46.07,13.33 46.07,17.75 | C4.2 46.07,19.08 46.07,17.75
N$12
  Bottom 0.254: U4.13 38.46,20.46 38.85,20.85 R10.1 C6.1
N$13
  Bottom 0.254: C8.1 C9.1 16.5,17 17,17.5 17,18.35 R12.2
N$14
  Bottom 0.254: R13.1 8.19,20.54 VR2.A VR2.S 11.37,19 C7.2
N$15
  Bottom 0.254: R13.2 4.51,18.15 VR1.S
N$16
  Bottom 0.254: C8.2 13.15,14 7.5,14 | VR1.E 5.83,14 7.5,14 | 7.5,14 7.5,15.5 8.5,16.5 11,16.5 12.5,18 14.6,18 15.02,18.43 15.02,19.62 15.18,19.78 15.78,19.78 16.5,20.5 20,20.5 20.75,19.75 28.5,19.75 29.21,20.46 U4.2
N$17
  Bottom 0.254: U4.3 29.73,21.73 29,21 R14.2
N$18  (via drill 0.35)
  Top 0.254: v36,16 v32,16
  Bottom 0.254: R15.1 v36,16 | v32,16 31.4,16.6 U4.1 22.69,19.19 21,17.5 21,15.5 19.5,14 15.4,14 15.02,14.38 15.02,16.13 C9.2 12.61,15.46 VR2.E
N$19
  Bottom 0.254: U3.3 29.73,61.73 29,61 R26.2
N$20
  Bottom 0.254: R16.2 17,38.35 17,37.5 16.5,37 C12.1 C11.1
N$21
  Bottom 0.254: R17.1 8.19,40.54 VR4.A VR4.S 11.37,39 C10.2
N$22
  Bottom 0.254: R17.2 4.51,38.15 VR3.S
N$23  (via drill 0.35)
  Top 0.254: v38.5,25.75 38.25,26 34.5,26 v32,28.5
  Bottom 0.254: C11.2 14,35 13,34 | 13,34 5.83,34 VR3.E | 13,34 13.5,33.5 16,33.5 31,33.5 32,32.5 v32,28.5 | U4.9 38.29,25.54 v38.5,25.75
N$24  (via drill 0.35)
  Top 0.254: v32,34 v36,34
  Bottom 0.254: VR4.E 11.9,37 C12.2 15,36.15 15,34.41 15.4,34 v32,34 | U4.8 38.81,26.81 40,28 40,34 | 40,34 40,36 41,37 R22.1 | v36,34 40,34
N$25
  Bottom 0.254: C18.1 15.89,76.96 | 15.89,76.96 C17.1 | R24.2 17,78.35 17,77.5 16.46,76.96 15.89,76.96
N$26
  Bottom 0.254: R18.2 17,58.35 17,57.5 16.5,57 C15.1 C14.1
N$27
  Bottom 0.254: R19.1 8.19,60.54 VR6.A VR6.S 11.37,59 C13.2
N$28
  Bottom 0.254: R19.2 4.51,58.15 VR5.S
N$29  (via drill 0.35)
  Top 0.254: v38.5,44 38,44.5 34,44.5 v32,46.5
  Bottom 0.254: C14.2 13.15,54 | VR5.E 5.83,54 13.15,54 | U5.2 38.13,43.63 v38.5,44 | v32,46.5 32,52 30.5,53.5 13.65,53.5 13.15,54
N$30  (via drill 0.35)
  Top 0.254: v32,54 v36,54
  Bottom 0.254: VR6.E 11.9,57 C15.2 15,56.15 15,54.41 15.4,54 v32,54 | R23.1 40.5,57 39.5,56 39.5,54 | 39.5,54 39.5,46 38.41,44.91 U5.1 | v36,54 39.5,54
N$31
  Bottom 0.254: U4.10 38.27,24.27 39,25 R20.2
N$32
  Bottom 0.254: U5.3 38.37,42.37 39,43 R21.2
N$33
  Bottom 0.254: R25.1 8.19,80.54 VR8.A VR8.S 11.37,79 C16.2
N$34  (via drill 0.35)
  Bottom 0.254: R25.2 v4.51,78.15 VR7.S
N$35  (via drill 0.35)
  Top 0.254: v19,73.5 20,73.5 21.5,72 v21.5,71
  Bottom 0.254: VR7.E v5.83,74 13,74 14,75 C17.2 14.61,74.58 14.61,74.26 15.37,73.5 v19,73.5 | v21.5,71 21.5,63.08 21.91,62.67 21.91,60.09 22.25,59.75 28.75,59.75 29.46,60.46 U3.2
N$36  (via drill 0.35)
  Top 0.254: 29,65.5 v29,59 | v20,74.5 29,65.5 | 29,65.5 31.5,68 v35.28,68
  Bottom 0.254: VR8.E 11.9,77 C18.2 15.02,76.13 15.02,74.42 15.45,74 18,74 18.5,74.5 v20,74.5 | R27.1 43.91,75.76 43.91,74.33 42.58,73 37,73 35.5,71.5 35.5,68.22 v35.28,68 | v29,59 31.21,59 U3.1
N$37  (via drill 0.35)
  Top 0.254: v44.09,72.16 38.84,72.16 36,75 27.15,75 23,79.15 v23,81
  Bottom 0.254: C21.1 R30.2 45.69,72.16 v44.09,72.16 | v23,81 C19.2
N$38
  Bottom 0.254: U3.10 38.27,64.27 39,65 R31.2 C35.2
N$39
  Bottom 0.254: C21.2 45.15,68.65 43.65,67.15 R29.2 42,67.15 C35.1
N$40
  Bottom 0.254: U16.3 38.12,7.37 38.75,8 R65.1
N$41
  Bottom 0.254: U3.8 37.81,66.81 38.5,67.5 38.5,68.5 39,69 C34.2 R41.2 41.15,72 43,72 | R29.1 43.5,71.5 43,72 | R42.1 54.15,92 65,92 66.5,90.5 66.5,75.5 64,73 44,73 43,72
N$42
  Bottom 0.254: C23.1 C24.1 16.5,87 17,87.5 17,88.35 R32.2
N$43
  Bottom 0.254: R33.1 8.19,90.54 VR10.A VR10.S 11.37,89 C22.2
N$44
  Bottom 0.254: R39.2 4.51,28.15 VR15.S
N$45  (via drill 0.35)
  Top 0.254: v27.5,73.5 20.5,80.5 20.5,82.42 19.46,83.46 18.46,83.46 v18,83
  Bottom 0.254: C23.2 14,85 13,84 | 13,84 5.83,84 VR9.E | U3.6 29.46,65.54 28.59,66.41 28.59,72.5 27.59,73.5 v27.5,73.5 | v18,83 14,83 13,84
N$46  (via drill 0.35)
  Top 0.254: v36,73.5 v32,73.5 31,74.5 27.07,74.5 21,80.58 21,82.5 19.5,84 v17.5,84
  Bottom 0.254: VR10.E 11.9,87 C24.2 15,86.15 15,84.41 15.4,84 v17.5,84 | R47.1 43.5,83.35 43.5,74.5 42.5,73.5 v36,73.5 | U3.7 29.69,66.81 29,67.5 29,72.5 30,73.5 v32,73.5
N$47
  Bottom 0.254: R34.2 17,68.35 17,67.5 16.5,67 C27.1 C26.1
N$48
  Bottom 0.254: R35.1 8.19,70.54 VR12.A VR12.S 11.37,69 C25.2
N$49
  Bottom 0.254: R37.2 4.51,48.15 VR13.S
N$50  (via drill 0.35)
  Top 0.254: v31.5,58 34,60.5 38.25,60.5 v38.5,60.25
  Bottom 0.254: VR11.E 5.83,64 13,64 14,65 C26.2 15.65,63.5 20.5,63.5 21.5,62.5 21.5,59 22.5,58 v31.5,58 | U3.13 38.29,60.46 v38.5,60.25
N$51  (via drill 0.35)
  Top 0.254: v35.5,57 v32,57
  Bottom 0.254: C27.2 11.9,67 VR12.E 9.07,66.75 3,66.75 2,65.75 2,64.5 3,63.5 15.07,63.5 15.48,63.09 20.33,63.09 21.09,62.33 21.09,58.83 22.33,57.59 30.41,57.59 31,57 v32,57 | R48.1 39.96,59.19 U3.14 36.6,58.1 v35.5,57
N$52
  Bottom 0.254: R36.2 C30.1 C29.1
N$53
  Bottom 0.254: R37.1 8.19,50.54 VR14.A VR14.S 11.37,49 C28.2
N$54
  Bottom 0.254: R35.2 4.51,68.15 VR11.S
N$55
  Bottom 0.254: 14,45 C29.2 14.15,44.35 15.5,43 | U5.6 28.64,42.37 28,43 15.5,43 | VR13.E 6.83,43 15.5,43
N$56  (via drill 0.35)
  Top 0.254: v40,44.5 38.5,43 29.64,43 v29,43.63
  Bottom 0.254: VR14.E 11.9,47 C30.2 15,46.15 15,44.41 15.77,43.63 v29,43.63 U5.7 | R49.1 42.5,47 v40,44.5
N$57
  Bottom 0.254: R38.2 17,28.35 17,27.5 16.5,27 C33.1 C32.1
N$58
  Bottom 0.254: R39.1 8.19,30.54 VR16.A VR16.S 11.37,29 C31.2
N$59
  Bottom 0.254: R33.2 4.51,88.15 VR9.S
N$60
  Bottom 0.254: VR15.E 5.83,24 13,24 14,25 C32.2 14.15,24.68 15.24,23.59 21.67,23.59 24.07,26 29,26 29.46,25.54 U4.6
N$61  (via drill 0.35)
  Top 0.254: v40.5,27 39.5,26 39.5,25.5 39,25 34,25 32.19,26.81 v29.5,26.81
  Bottom 0.254: VR16.E 11.9,27 C33.2 15,26.15 15,24.41 15.4,24 21.5,24 24.31,26.81 v29.5,26.81 U4.7 | R50.1 v40.5,27
N$62
  Bottom 0.254: R51.2 49.05,4 VR100.2
N$63
  Bottom 0.254: U3.9 38.54,65.54 39,66 39,67.5 39.5,68 41,68 41.85,68.85 C34.1 R41.1
N$64
  Bottom 0.254: U3.5 29.73,64.27 29,65 R43.2
N$65
  Bottom 0.254: U3.12 38.27,61.73 39,61 R44.2
N$66
  Bottom 0.254: U5.5 31.3,41 R45.2
N$67
  Bottom 0.254: U4.5 29.73,24.27 29,25 R46.2
N$68
  Bottom 0.254: R66.1 28.95,6.09 U16.5
N$70
  Bottom 0.254: R52.2 49.05,14 VR200.2
N$71
  Bottom 0.254: U16.1 37.91,9.9 39.85,11.85 R61.1 C20.2 44,9.85 44,6 44.5,5.5 50,5.5 50.75,4.75 50.75,3.25 49.75,2.25 43.6,2.25 C36.1
N$72
  Bottom 0.254: R53.2 48.43,25 VR350.2
N$73
  Bottom 0.254: C36.2 34.5,4 33.5,3 R62.2
N$74
  Bottom 0.254: R54.2 49.05,34 VR500.2
N$75
  Bottom 0.254: U16.6 29.61,7.37 29.4,7.15 C37.1 R63.2 R64.2 24,4 25,3 R62.1
N$76
  Bottom 0.254: R55.2 49.05,44 VR700.2
N$77
  Bottom 0.254: R67.2 12.05,3.05 17.85,8.85 19,8.85 R64.1 R63.1 C37.2 29.4,8.85 29.61,8.63 U16.7
N$78
  Bottom 0.254: R56.2 49.05,54 VR1K.2
N$79
  Bottom 0.254: R67.1 4.95,3.05 3,5 SUM_OUT.P$1_TIP
N$80
  Bottom 0.254: R57.2 49.05,64 VR1.4K.2
N$81
  Bottom 0.508: JP2.9 JP2.10 28.82,102.17 28,103 24.1,103 D2.A
N$82
  Bottom 0.254: R58.2 49.05,74 VR2K.2
N$83
  Bottom 0.254: R69.1 18.57,12 VR100.B
N$84
  Bottom 0.254: VR3.5K.2 48.05,83 R59.2
N$85
  Bottom 0.508: JP2.1 39.08,102 | 39.08,102 JP2.2 | D1.C 44.4,103 40.08,103 39.08,102
N$86
  Bottom 0.254: VR7K.2 49.58,93.85 R60.2
N$87
  Bottom 0.254: R70.1 18.57,22 VR200.B
N$88
  Bottom 0.254: R71.1 18.57,32 VR350.B
N$89
  Bottom 0.254: R72.1 18.57,42 VR500.B
N$90
  Bottom 0.254: R73.1 18.57,52 VR700.B
N$91
  Bottom 0.254: R74.1 18.57,62 VR1K.B
N$92
  Bottom 0.254: R75.1 18.57,72 VR1.4K.B
N$93
  Bottom 0.254: R76.1 18.57,82 VR2K.B
N$94
  Bottom 0.254: R77.1 18.57,92 VR3.5K.B
N$95
  Bottom 0.254: R78.1 18.57,102 VR7K.B
N$96
  Bottom 0.254: C55.1 R1.1
VCC  (via drill 0.35)
  Top 0.254: v14,13.5 v14,20.5 v14,30.5 v14,40.5 v14,50.5 14,57 v14,60.5 v14,70.5 14,77 14,80 v14,80.5 14,93.35 v14.15,93.5
  Bottom 0.254: U16.8 30.09,9.9 29,11 C51.1 | C49.1 U4.4 | R77.2 v14.15,93.5 14.15,95.35 13,96.5 13,100.85 R78.2 17.3,98.85 18.25,98.85 21,96.1 | U2.8 30.09,79.91 29,81 C45.1 | U5.8 31.3,45 C47.1 | U3.4 C43.1 | R69.2 14.15,13.35 v14,13.5 | v14,20.5 14,21.85 R70.2 | v14,30.5 14,31.85 R71.2 | v14,40.5 14,41.85 R72.2 | v14,50.5 14,51.85 R73.2 | v14,60.5 14,61.85 R74.2 | v14,70.5 14,71.85 R75.2 | v14,80.5 14,81.85 R76.2
  Bottom 0.508: D2.C 21,96.1 21,89 21.6,88.4 C41.+ 25.8,85.6 C39.+ 31.4,85.6 33.5,83.5 33.5,80 | U16.8 32.41,9.9 33.5,11 33.5,23 | 33.5,23 33.5,45 | 33.5,45 33.5,63 | 33.5,63 33.5,80 | U2.8 33.41,79.91 33.5,80 | U3.4 33.5,63 | U5.8 33.41,44.91 33.5,45 | U4.4 33.5,23
VEE
  Bottom 0.254: U16.4 40.05,6.09 C50.2 | C48.2 U4.11 | U2.4 37.91,76.09 39,75 C42.2 | U3.11 C44.2 | U5.4 36.7,41 C46.2
  Bottom 0.508: D1.A 45,96.6 C40.- 39.6,91.6 38,90 C38.- 34.5,86.9 34.5,76 | U16.4 34.91,6.09 34.5,6.5 34.5,23 | 34.5,23 34.5,41 | 34.5,41 34.5,63 | 34.5,63 34.5,76 | U2.4 34.59,76.09 34.5,76 | U3.11 34.5,63 | U5.4 34.59,41.09 34.5,41 | U4.11 34.5,23

### Text on the board
Top: Place trim pots / on back of board!
bPlace: cc-by-sa Matt Gaines, 2018. v3 | Original schematic by / Don Buchla | 295 | MMI Modular
tStop: Place trim pots / on back of board!